# Altium schematic sheet Main.SchDoc
size A4
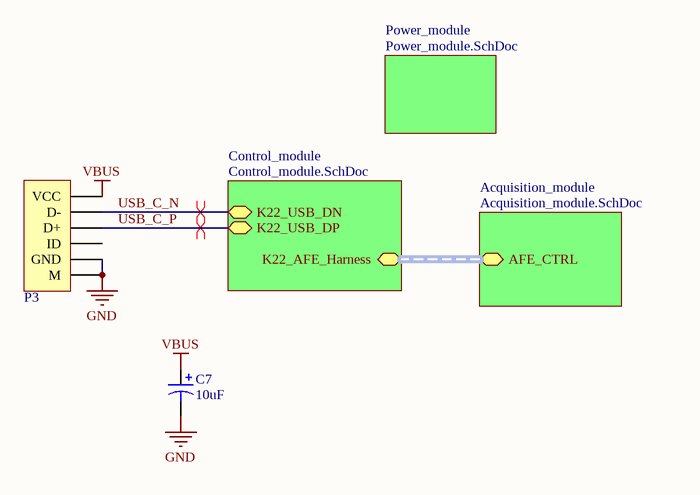
[diagram p0: Main.SchDoc]

## Parts
C7  value 10uF  [CAP SMD 4mm]  (hidden comment: Cap Pol1)
P3  USB Header  [MicroUSB-B]  (value not drawn)

## Sub-sheets
Acquisition_module = Acquisition_module.SchDoc: AFE_CTRL (harness AFE_Harness)
Control_module = Control_module.SchDoc: K22_AFE_Harness (harness AFE_Harness), K22_USB_DP (bidir), K22_USB_DN (bidir)
Power_module = Power_module.SchDoc: no entries

## Nets
GND: C7.2 P3.GND P3.M
VBUS: C7.1 P3.VCC
USB_C_N: P3.D- ; sheet Control_module/K22_USB_DN
USB_C_P: P3.D+ ; sheet Control_module/K22_USB_DP

Not connected (* = marked no-connect by the designer): P3 ID

## Buses and harness runs
harness sheet Acquisition_module/AFE_CTRL = sheet Control_module/K22_AFE_Harness

## Layout directives
differential pair: USB_C_N, USB_C_P

## Library data of the parts
C7 = Cap Pol1: Polarized Capacitor (Radial); Published: 8-Jun-2000; LatestRevisionDate: 17-Jul-2002; LatestRevisionNote: Re-released for DXP Platform.; PackageReference: RB7.6-15; Publisher: Altium Limited; PackageDescription: Polarized Capacitor (Radial); 2 Leads
P3 = USB 7 pin Header: LatestRevisionDate: 17-Jul-2002; LatestRevisionNote: Re-released for DXP Platform.; Publisher: Altium Limited